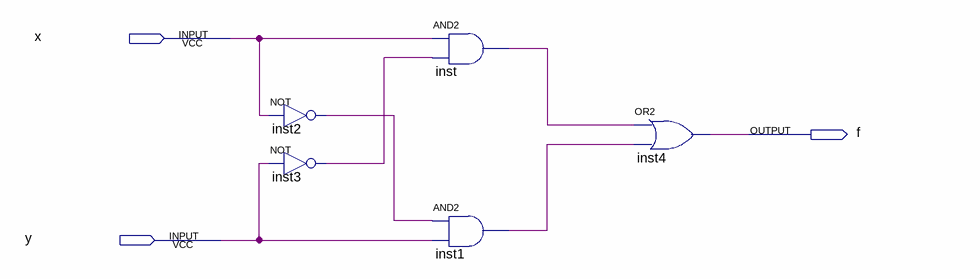
[diagram p0: schematic sheet]
// Quartus schematic Lab01.bdf as structural Verilog: 5 symbols, 3 pins
module Lab01 (
  input  x,
  input  y,
  output f
);

  wire inst1_out, inst2_out, inst3_out, inst_out;

  not inst2 (inst2_out, x);
  not inst3 (inst3_out, y);
  and inst (inst_out, x, inst3_out);
  and inst1 (inst1_out, inst2_out, y);
  or inst4 (f, inst_out, inst1_out);
endmodule
